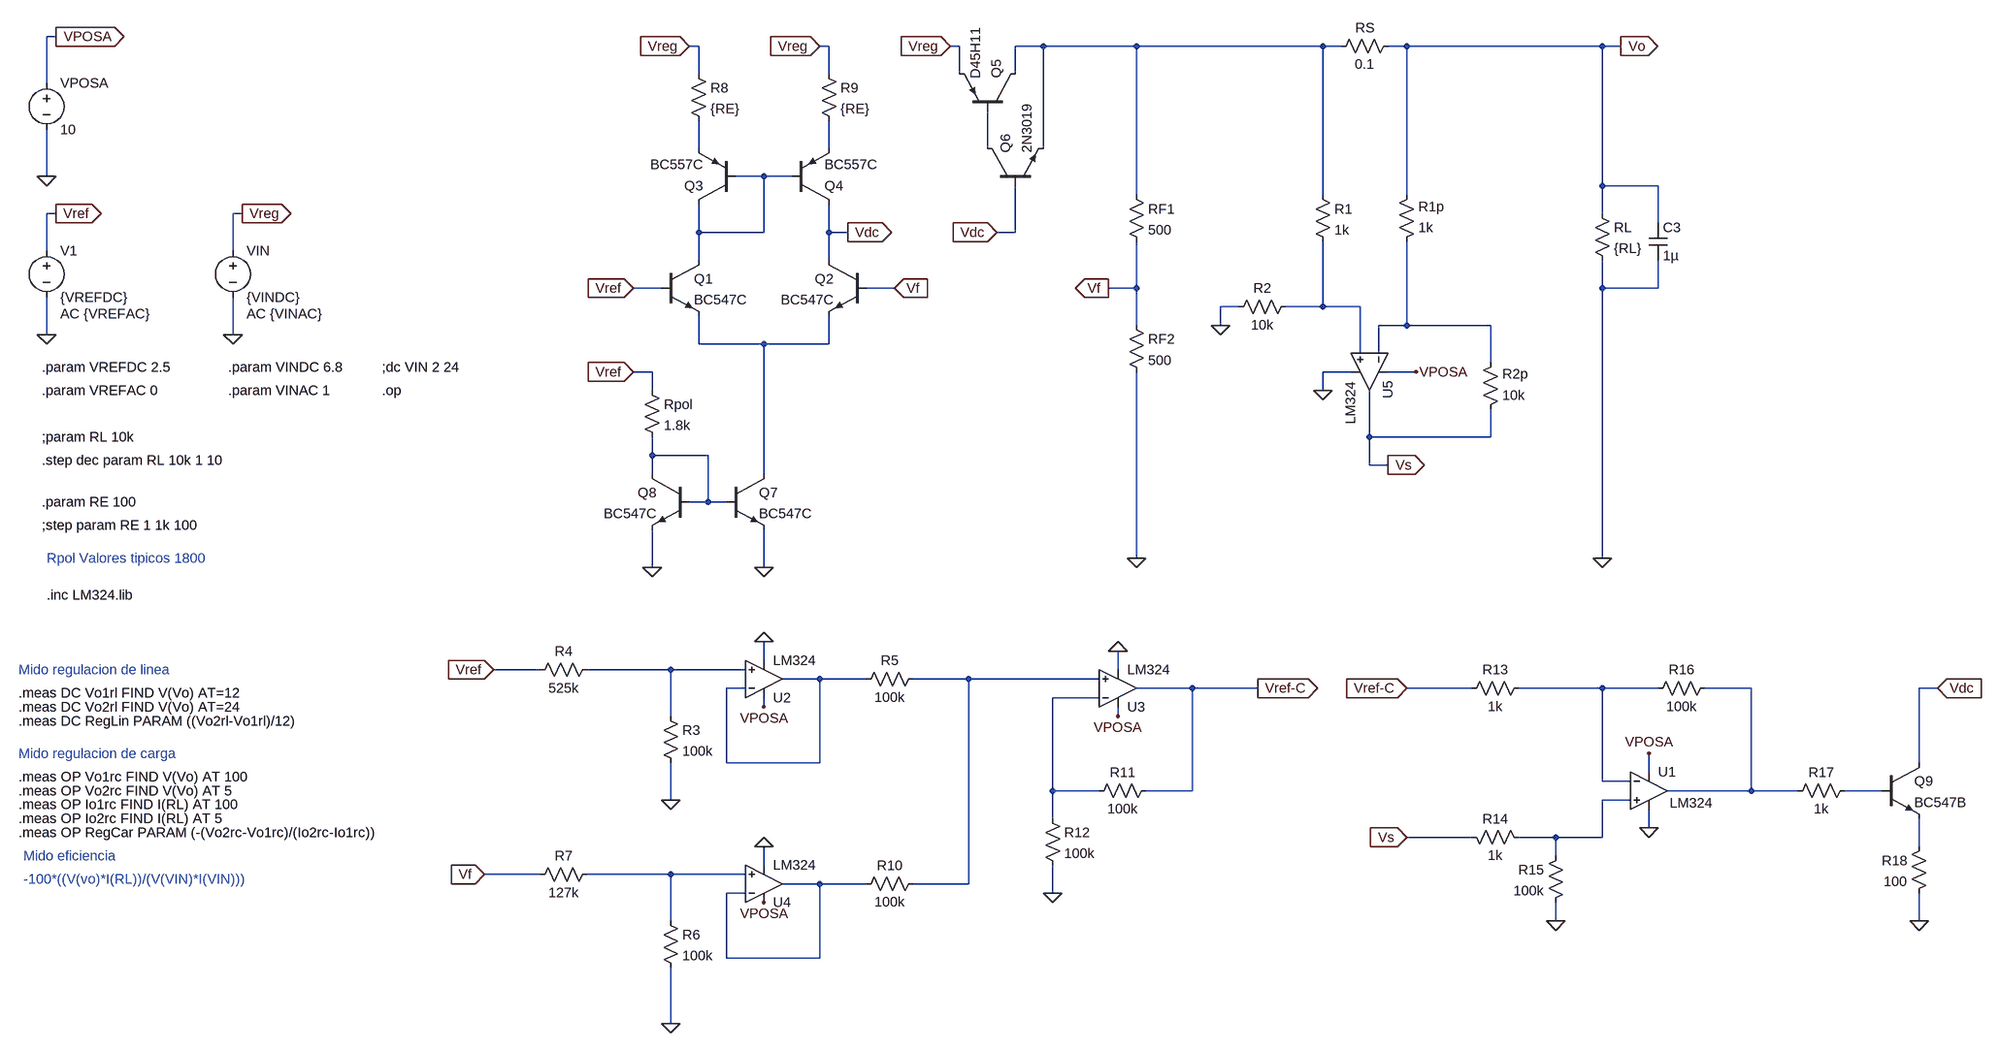
[diagram p0: schematic Version 3.asc]
Version 3.asc, the LTspice schematic file:
Version 4
SHEET 1 3148 2132
WIRE -1008 -144 -1024 -144
WIRE 96 -128 80 -128
WIRE 320 -128 304 -128
WIRE 544 -128 528 -128
WIRE 688 -128 640 -128
WIRE 848 -128 688 -128
WIRE 1168 -128 848 -128
WIRE 1200 -128 1168 -128
WIRE 1312 -128 1280 -128
WIRE 1648 -128 1312 -128
WIRE 1680 -128 1648 -128
WIRE 96 -80 96 -128
WIRE 320 -80 320 -128
WIRE 544 -80 544 -128
WIRE 640 -80 640 -128
WIRE -1024 -64 -1024 -144
WIRE 96 48 96 0
WIRE 320 48 320 0
WIRE 592 48 592 -16
WIRE 688 48 688 -128
WIRE -1024 96 -1024 16
WIRE 208 96 160 96
WIRE 256 96 208 96
WIRE 1648 112 1648 -128
WIRE 1744 112 1648 112
WIRE 848 128 848 -128
WIRE 1168 128 1168 -128
WIRE 1312 128 1312 -128
WIRE -1008 160 -1024 160
WIRE -688 160 -704 160
WIRE 1648 160 1648 112
WIRE 1744 176 1744 112
WIRE 96 192 96 144
WIRE 208 192 208 96
WIRE 208 192 96 192
WIRE 320 192 320 144
WIRE 352 192 320 192
WIRE 640 192 640 112
WIRE 640 192 608 192
WIRE -1024 224 -1024 160
WIRE -704 224 -704 160
WIRE 96 240 96 192
WIRE 320 240 320 192
WIRE 32 288 -16 288
WIRE 432 288 384 288
WIRE 848 288 848 208
WIRE 848 288 800 288
WIRE 1648 288 1648 240
WIRE 1744 288 1744 240
WIRE 1744 288 1648 288
WIRE 1024 320 992 320
WIRE 1168 320 1168 208
WIRE 1168 320 1104 320
WIRE 1232 320 1168 320
WIRE 848 352 848 288
WIRE 992 352 992 320
WIRE 1312 352 1312 208
WIRE 1312 352 1264 352
WIRE 1456 352 1312 352
WIRE -1024 368 -1024 304
WIRE -704 368 -704 304
WIRE 96 384 96 336
WIRE 208 384 96 384
WIRE 320 384 320 336
WIRE 320 384 208 384
WIRE 1232 400 1232 320
WIRE 1264 400 1264 352
WIRE 1456 416 1456 352
WIRE 16 432 -16 432
WIRE 1216 432 1168 432
WIRE 1328 432 1280 432
WIRE 16 464 16 432
WIRE 1168 464 1168 432
WIRE 1248 544 1248 464
WIRE 1456 544 1456 496
WIRE 1456 544 1248 544
WIRE 16 576 16 544
WIRE 112 576 16 576
WIRE 1248 592 1248 544
WIRE 1280 592 1248 592
WIRE 16 608 16 576
WIRE 208 608 208 384
WIRE 112 656 112 576
WIRE 112 656 80 656
WIRE 144 656 112 656
WIRE 848 752 848 432
WIRE 1648 752 1648 288
WIRE 16 768 16 704
WIRE 208 768 208 704
WIRE 208 928 208 896
WIRE -176 944 -256 944
WIRE 48 944 -96 944
WIRE 176 944 48 944
WIRE 816 944 816 912
WIRE 304 960 240 960
WIRE 384 960 304 960
WIRE 560 960 464 960
WIRE 784 960 560 960
WIRE 176 976 144 976
WIRE 944 976 848 976
WIRE 1056 976 944 976
WIRE 1424 976 1312 976
WIRE 1648 976 1504 976
WIRE 1744 976 1648 976
WIRE 1904 976 1824 976
WIRE 2224 976 2192 976
WIRE 784 992 704 992
WIRE 208 1008 208 992
WIRE 48 1024 48 944
WIRE 816 1024 816 1008
WIRE 144 1104 144 976
WIRE 304 1104 304 960
WIRE 304 1104 144 1104
WIRE 2192 1104 2192 976
WIRE 1728 1120 1728 1088
WIRE 1648 1136 1648 976
WIRE 1696 1136 1648 1136
WIRE 704 1152 704 992
WIRE 784 1152 704 1152
WIRE 944 1152 944 976
WIRE 944 1152 864 1152
WIRE 1904 1152 1904 976
WIRE 1904 1152 1760 1152
WIRE 1984 1152 1904 1152
WIRE 2128 1152 2064 1152
WIRE 48 1168 48 1104
WIRE 1696 1168 1648 1168
WIRE 704 1200 704 1152
WIRE 1728 1216 1728 1184
WIRE 1424 1232 1312 1232
WIRE 1568 1232 1504 1232
WIRE 1648 1232 1648 1168
WIRE 1648 1232 1568 1232
WIRE 2192 1248 2192 1200
WIRE 1568 1264 1568 1232
WIRE 208 1280 208 1248
WIRE -176 1296 -272 1296
WIRE 48 1296 -96 1296
WIRE 176 1296 48 1296
WIRE 304 1312 240 1312
WIRE 384 1312 304 1312
WIRE 560 1312 560 960
WIRE 560 1312 464 1312
WIRE 176 1328 144 1328
WIRE 704 1328 704 1280
WIRE 48 1376 48 1296
WIRE 1568 1376 1568 1344
WIRE 2192 1376 2192 1328
WIRE 144 1440 144 1328
WIRE 304 1440 304 1312
WIRE 304 1440 144 1440
WIRE 48 1552 48 1456
FLAG 1680 -128 Vo
IOPIN 1680 -128 Out
FLAG -1008 160 Vref
IOPIN -1008 160 Out
FLAG -1024 368 0
FLAG -688 160 Vreg
IOPIN -688 160 Out
FLAG 1648 752 0
FLAG 848 752 0
FLAG -16 288 Vref
IOPIN -16 288 In
FLAG -16 432 Vref
IOPIN -16 432 In
FLAG -704 368 0
FLAG 16 768 0
FLAG 208 768 0
FLAG 80 -128 Vreg
IOPIN 80 -128 In
FLAG 304 -128 Vreg
IOPIN 304 -128 In
FLAG 528 -128 Vreg
IOPIN 528 -128 In
FLAG 1568 1376 0
FLAG 2192 1376 0
FLAG 48 1168 0
FLAG 48 1552 0
FLAG 704 1328 0
FLAG 208 1008 VPOSA
FLAG 816 1024 VPOSA
FLAG 1728 1088 VPOSA
FLAG 208 1344 VPOSA
FLAG 208 1248 0
FLAG 208 896 0
FLAG 816 912 0
FLAG 1728 1216 0
FLAG -272 1296 Vf
IOPIN -272 1296 In
FLAG -256 944 Vref
IOPIN -256 944 In
FLAG 1312 976 Vref-C
IOPIN 1312 976 In
FLAG 1312 1232 Vs
IOPIN 1312 1232 In
FLAG 1056 976 Vref-C
IOPIN 1056 976 Out
FLAG 1328 432 VPOSA
FLAG 992 352 0
FLAG 1168 464 0
FLAG 1280 592 Vs
IOPIN 1280 592 Out
FLAG -1024 96 0
FLAG -1008 -144 VPOSA
IOPIN -1008 -144 Out
FLAG 352 192 Vdc
IOPIN 352 192 Out
FLAG 608 192 Vdc
IOPIN 608 192 In
FLAG 2224 976 Vdc
IOPIN 2224 976 In
FLAG 800 288 Vf
IOPIN 800 288 Out
FLAG 432 288 Vf
IOPIN 432 288 In
DATAFLAG 16 288 ""
DATAFLAG 112 192 ""
DATAFLAG 224 96 ""
DATAFLAG 320 32 ""
DATAFLAG 48 944 ""
DATAFLAG 48 1296 ""
DATAFLAG -224 1296 ""
DATAFLAG -224 944 ""
DATAFLAG 1008 -128 ""
DATAFLAG 432 288 ""
DATAFLAG 848 288 ""
SYMBOL pnp 160 144 R180
SYMATTR InstName Q3
SYMATTR Value BC557C
SYMBOL pnp 256 144 M180
SYMATTR InstName Q4
SYMATTR Value BC557C
SYMBOL npn 32 240 R0
SYMATTR InstName Q1
SYMATTR Value BC547C
SYMBOL npn 384 240 M0
SYMATTR InstName Q2
SYMATTR Value BC547C
SYMBOL pnp 640 -16 M270
SYMATTR InstName Q5
SYMATTR Value D45H11
SYMBOL npn 592 112 R270
SYMATTR InstName Q6
SYMATTR Value 2N3019
SYMBOL res 832 112 R0
SYMATTR InstName RF1
SYMATTR Value 500
SYMBOL res 832 336 R0
SYMATTR InstName RF2
SYMATTR Value 500
SYMBOL res 1632 144 R0
SYMATTR InstName RL
SYMATTR Value {RL}
SYMBOL voltage -1024 208 R0
WINDOW 123 24 124 Left 2
WINDOW 39 0 0 Left 0
SYMATTR Value2 AC {VREFAC}
SYMATTR InstName V1
SYMATTR Value {VREFDC}
SYMBOL res 80 -96 R0
SYMATTR InstName R8
SYMATTR Value {RE}
SYMBOL res 304 -96 R0
SYMATTR InstName R9
SYMATTR Value {RE}
SYMBOL cap 1728 176 R0
SYMATTR InstName C3
SYMATTR Value 1µ
SYMBOL voltage -704 208 R0
WINDOW 123 24 124 Left 2
WINDOW 39 0 0 Left 0
SYMATTR Value2 AC {VINAC}
SYMATTR InstName VIN
SYMATTR Value {VINDC}
SYMBOL npn 144 608 R0
SYMATTR InstName Q7
SYMATTR Value BC547C
SYMBOL npn 80 608 M0
SYMATTR InstName Q8
SYMATTR Value BC547C
SYMBOL res 0 448 R0
SYMATTR InstName Rpol
SYMATTR Value 1.8k
SYMBOL npn 2128 1104 R0
SYMATTR InstName Q9
SYMATTR Value BC547B
SYMBOL OpAmps\\opamp2 1728 1088 R0
WINDOW 3 36 85 Left 2
SYMATTR Value LM324
SYMATTR InstName U1
SYMBOL OpAmps\\opamp2 208 1024 M180
SYMATTR InstName U2
SYMATTR Value LM324
SYMBOL OpAmps\\opamp2 816 1040 M180
SYMATTR InstName U3
SYMATTR Value LM324
SYMBOL OpAmps\\opamp2 208 1376 M180
SYMATTR InstName U4
SYMATTR Value LM324
SYMBOL res 1296 -144 R90
WINDOW 0 0 56 VBottom 2
WINDOW 3 32 56 VTop 2
SYMATTR InstName RS
SYMATTR Value 0.1
SYMBOL OpAmps\\opamp2 1312 432 R90
SYMATTR InstName U5
SYMATTR Value LM324
SYMBOL voltage -1024 -80 R0
SYMATTR InstName VPOSA
SYMATTR Value 10
SYMBOL res 1152 112 R0
SYMATTR InstName R1
SYMATTR Value 1k
SYMBOL res 1120 304 R90
WINDOW 0 0 56 VBottom 2
WINDOW 3 32 56 VTop 2
SYMATTR InstName R2
SYMATTR Value 10k
SYMBOL res 1296 224 M180
WINDOW 0 36 76 Left 2
WINDOW 3 36 40 Left 2
SYMATTR InstName R1p
SYMATTR Value 1k
SYMBOL res 1440 512 M180
WINDOW 0 36 76 Left 2
WINDOW 3 36 40 Left 2
SYMATTR InstName R2p
SYMATTR Value 10k
SYMBOL res 32 1008 R0
SYMATTR InstName R3
SYMATTR Value 100k
SYMBOL res -80 928 R90
WINDOW 0 0 56 VBottom 2
WINDOW 3 32 56 VTop 2
SYMATTR InstName R4
SYMATTR Value 525k
SYMBOL res 480 944 R90
WINDOW 0 0 56 VBottom 2
WINDOW 3 32 56 VTop 2
SYMATTR InstName R5
SYMATTR Value 100k
SYMBOL res 32 1360 R0
SYMATTR InstName R6
SYMATTR Value 100k
SYMBOL res -80 1280 R90
WINDOW 0 0 56 VBottom 2
WINDOW 3 32 56 VTop 2
SYMATTR InstName R7
SYMATTR Value 127k
SYMBOL res 480 1296 R90
WINDOW 0 0 56 VBottom 2
WINDOW 3 32 56 VTop 2
SYMATTR InstName R10
SYMATTR Value 100k
SYMBOL res 880 1136 R90
WINDOW 0 0 56 VBottom 2
WINDOW 3 32 56 VTop 2
SYMATTR InstName R11
SYMATTR Value 100k
SYMBOL res 688 1184 R0
SYMATTR InstName R12
SYMATTR Value 100k
SYMBOL res 1408 992 R270
WINDOW 0 32 56 VTop 2
WINDOW 3 0 56 VBottom 2
SYMATTR InstName R13
SYMATTR Value 1k
SYMBOL res 1408 1216 M90
WINDOW 0 0 56 VBottom 2
WINDOW 3 32 56 VTop 2
SYMATTR InstName R14
SYMATTR Value 1k
SYMBOL res 1584 1248 M0
SYMATTR InstName R15
SYMATTR Value 100k
SYMBOL res 1728 992 R270
WINDOW 0 32 56 VTop 2
WINDOW 3 0 56 VBottom 2
SYMATTR InstName R16
SYMATTR Value 100k
SYMBOL res 1968 1168 R270
WINDOW 0 32 56 VTop 2
WINDOW 3 0 56 VBottom 2
SYMATTR InstName R17
SYMATTR Value 1k
SYMBOL res 2208 1232 M0
SYMATTR InstName R18
SYMATTR Value 100
TEXT -448 464 Left 2 !.op
TEXT -712 424 Left 2 !.param VINDC 6.8
TEXT -712 464 Left 2 !.param VINAC 1
TEXT -1032 424 Left 2 !.param VREFDC 2.5
TEXT -1032 464 Left 2 !.param VREFAC 0
TEXT -1032 544 Left 2 !;param RL 10k
TEXT -448 424 Left 2 !;dc VIN 2 24
TEXT -1032 696 Left 2 !;step param RE 1 1k 100
TEXT -1032 656 Left 2 !.param RE 100
TEXT -1032 584 Left 2 !.step dec param RL 10k 1 10
TEXT -1072 944 Left 2 ;Mido regulacion de linea
TEXT -1072 984 Left 2 !.meas DC Vo1rl FIND V(Vo) AT=12
TEXT -1072 1008 Left 2 !.meas DC Vo2rl FIND V(Vo) AT=24
TEXT -1072 1032 Left 2 !.meas DC RegLin PARAM ((Vo2rl-Vo1rl)/12)
TEXT -1072 1088 Left 2 ;Mido regulacion de carga
TEXT -1072 1128 Left 2 !.meas OP Vo1rc FIND V(Vo) AT 100
TEXT -1072 1152 Left 2 !.meas OP Vo2rc FIND V(Vo) AT 5
TEXT -1072 1176 Left 2 !.meas OP Io1rc FIND I(RL) AT 100
TEXT -1072 1200 Left 2 !.meas OP Io2rc FIND I(RL) AT 5
TEXT -1064 1264 Left 2 ;Mido eficiencia
TEXT -1064 1304 Left 2 ;-100*((V(vo)*I(RL))/(V(VIN)*I(VIN)))
TEXT -1072 1224 Left 2 !.meas OP RegCar PARAM (-(Vo2rc-Vo1rc)/(Io2rc-Io1rc))
TEXT -1024 752 Left 2 ;Rpol Valores tipicos 1800
TEXT -1024 816 Left 2 !.inc LM324.lib

The netlist it stands for:
* Version 3.asc
Q3 N005 N005 N002 0 BC557C
Q4 Vdc N005 N003 0 BC557C
Q1 N005 Vref N008 0 BC547C
Q2 Vdc Vf N008 0 BC547C
Q5 N001 N004 Vreg 0 D45H11
Q6 N004 Vdc N001 0 2N3019
RF1 N001 Vf 500
RF2 Vf 0 500
RL Vo 0 {RL}
V1 Vref 0 {VREFDC} AC {VREFAC}
R8 Vreg N002 {RE}
R9 Vreg N003 {RE}
C3 Vo 0 1µ
VIN Vreg 0 {VINDC} AC {VINAC}
Q7 N008 N009 0 0 BC547C
Q8 N009 N009 0 0 BC547C
Rpol Vref N009 1.8k
Q9 Vdc N016 N018 0 BC547B
XU1 N017 N013 VPOSA 0 N014 LM324  ; pins In+ In- V+ V- OUT
XU2 N010 N011 VPOSA 0 N011 LM324  ; pins In+ In- V+ V- OUT
XU3 N012 N015 VPOSA 0 Vref-C LM324  ; pins In+ In- V+ V- OUT
XU4 N019 N020 VPOSA 0 N020 LM324  ; pins In+ In- V+ V- OUT
RS Vo N001 0.1
XU5 N006 N007 VPOSA 0 Vs LM324  ; pins In+ In- V+ V- OUT
VPOSA VPOSA 0 10
R1 N001 N006 1k
R2 N006 0 10k
R1p N007 Vo 1k
R2p Vs N007 10k
R3 N010 0 100k
R4 N010 Vref 525k
R5 N012 N011 100k
R6 N019 0 100k
R7 N019 Vf 127k
R10 N012 N020 100k
R11 Vref-C N015 100k
R12 N015 0 100k
R13 Vref-C N013 1k
R14 Vs N017 1k
R15 N017 0 100k
R16 N013 N014 100k
R17 N014 N016 1k
R18 N018 0 100
.model NPN NPN
.model PNP PNP
.lib standard.bjt
.op
.param VINDC 6.8
.param VINAC 1
.param VREFDC 2.5
.param VREFAC 0
;param RL 10k
;dc VIN 2 24
;step param RE 1 1k 100
.param RE 100
.step dec param RL 10k 1 10
* Mido regulacion de linea
.meas DC Vo1rl FIND V(Vo) AT=12
.meas DC Vo2rl FIND V(Vo) AT=24
.meas DC RegLin PARAM ((Vo2rl-Vo1rl)/12)
* Mido regulacion de carga
.meas OP Vo1rc FIND V(Vo) AT 100
.meas OP Vo2rc FIND V(Vo) AT 5
.meas OP Io1rc FIND I(RL) AT 100
.meas OP Io2rc FIND I(RL) AT 5
* Mido eficiencia
* -100*((V(vo)*I(RL))/(V(VIN)*I(VIN)))
.meas OP RegCar PARAM (-(Vo2rc-Vo1rc)/(Io2rc-Io1rc))
* Rpol Valores tipicos 1800
.inc LM324.lib
.backanno
.end

* Results of the author's LTspice run, read from the files saved beside the schematic
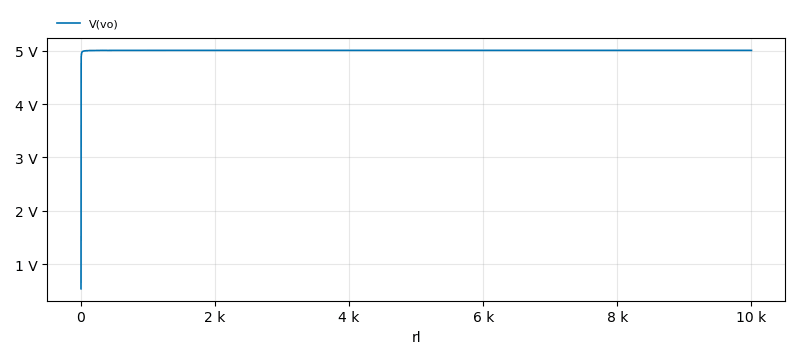
[diagram p1: Operating Point of Version 3.asc, plotted from the saved traces]
* Operating Point, 1 run:
*   V(vo): 539.5 mV at rl=1 , 5.007 V at rl=10 k, min 539.5 mV, max 5.007 V
* From the log:
*   Semiconductor Device Operating Points:
*                           --- Diodes ---
*   Name:    d:u5:p      d:u5:ln     d:u5:lp     d:u5:e      d:u5:c
*   Model:    u5:dx       u5:dx       u5:dx       u5:dx       u5:dx
*   Id:     -1.00e-11   -4.00e-11   -4.00e-11    6.42e-14   -7.36e-12
*   Vd:     -1.00e+01   -4.00e+01   -4.00e+01    5.76e-02   -7.36e+00
*   Req:     1.00e+12    1.00e+12    1.00e+12    7.77e+11    1.00e+12
*   CAP:     0.00e+00    0.00e+00    0.00e+00    0.00e+00    0.00e+00
*   Name:    d:u4:p      d:u4:ln     d:u4:lp     d:u4:e      d:u4:c
*   Model:    u4:dx       u4:dx       u4:dx       u4:dx       u4:dx
*   Id:     -1.00e-11   -4.00e-11   -4.00e-11    5.64e-08   -7.77e-12
*   Vd:     -1.00e+01   -4.00e+01   -4.00e+01    4.67e-01   -7.77e+00
*   Req:     1.00e+12    1.00e+12    1.00e+12    4.58e+05    1.00e+12
*   CAP:     0.00e+00    0.00e+00    0.00e+00    0.00e+00    0.00e+00
*   Name:    d:u3:p      d:u3:ln     d:u3:lp     d:u3:e      d:u3:c
*   Model:    u3:dx       u3:dx       u3:dx       u3:dx       u3:dx
*   Id:     -1.00e-11   -4.00e-11   -4.00e-11    7.39e-14   -7.37e-12
*   Vd:     -1.00e+01   -4.00e+01   -4.00e+01    6.49e-02   -7.36e+00
*   Req:     1.00e+12    1.00e+12    1.00e+12    7.25e+11    1.00e+12
*   CAP:     0.00e+00    0.00e+00    0.00e+00    0.00e+00    0.00e+00
*   Name:    d:u2:p      d:u2:ln     d:u2:lp     d:u2:e      d:u2:c
*   Model:    u2:dx       u2:dx       u2:dx       u2:dx       u2:dx
*   Id:     -1.00e-11   -4.00e-11   -4.00e-11    1.89e-12   -7.50e-12
*   Vd:     -1.00e+01   -4.00e+01   -4.00e+01    1.98e-01   -7.50e+00
*   Req:     1.00e+12    1.00e+12    1.00e+12    1.51e+10    1.00e+12
*   CAP:     0.00e+00    0.00e+00    0.00e+00    0.00e+00    0.00e+00
*   Name:    d:u1:p      d:u1:ln     d:u1:lp     d:u1:e      d:u1:c
*   Model:    u1:dx       u1:dx       u1:dx       u1:dx       u1:dx
*   Id:     -1.00e-11   -4.00e-11   -4.00e-11   -1.52e-13   -7.15e-12
*   Vd:     -1.00e+01   -4.00e+01   -4.00e+01   -1.52e-01   -7.15e+00
*   Req:     1.00e+12    1.00e+12    1.00e+12    1.00e+12    1.00e+12
*   CAP:     0.00e+00    0.00e+00    0.00e+00    0.00e+00    0.00e+00
*                           --- Bipolar Transistors ---
*   Name:     q:u5:2      q:u5:1      q:u4:2      q:u4:1      q:u3:2
*   Model:     u5:qx       u5:qx       u4:qx       u4:qx       u3:qx
*   Ib:      -2.05e-08   -2.03e-08   -2.06e-08   -2.02e-08   -2.05e-08
*   Ic:      -5.11e-06   -5.08e-06   -5.16e-06   -5.05e-06   -5.12e-06
*   Vbe:     -5.84e-01   -5.84e-01   -5.84e-01   -5.84e-01   -5.84e-01
*   Vbc:      4.99e-01    4.99e-01    9.07e-02    9.24e-02    2.28e-01
*   Vce:     -1.08e+00   -1.08e+00   -6.75e-01   -6.76e-01   -8.12e-01
*   BetaDC:   2.50e+02    2.50e+02    2.50e+02    2.50e+02    2.50e+02
*   Gm:       1.98e-04    1.96e-04    2.00e-04    1.95e-04    1.98e-04
*   Rpi:      1.26e+06    1.27e+06    1.25e+06    1.28e+06    1.26e+06
*   Rx:       0.00e+00    0.00e+00    0.00e+00    0.00e+00    0.00e+00
*   Ro:       7.69e+21    7.85e+21    1.08e+15    1.15e+15    2.14e+17
*   Cbe:      0.00e+00    0.00e+00    0.00e+00    0.00e+00    0.00e+00
*   Cbc:      0.00e+00    0.00e+00    0.00e+00    0.00e+00    0.00e+00
*   Cjs:      0.00e+00    0.00e+00    0.00e+00    0.00e+00    0.00e+00
*   BetaAC:   2.50e+02    2.50e+02    2.50e+02    2.50e+02    2.50e+02
*   Cbx:      0.00e+00    0.00e+00    0.00e+00    0.00e+00    0.00e+00
*   Ft:       0.00e+00    0.00e+00    0.00e+00    0.00e+00    0.00e+00
*   Name:     q:u3:1      q:u2:2      q:u2:1      q:u1:2      q:u1:1
*   Model:     u3:qx       u2:qx       u2:qx       u1:qx       u1:qx
*   Ib:      -2.03e-08   -2.05e-08   -2.03e-08   -2.05e-08   -2.03e-08
*   Ic:      -5.09e-06   -5.12e-06   -5.08e-06   -5.11e-06   -5.08e-06
*   Vbe:     -5.84e-01   -5.84e-01   -5.84e-01   -5.84e-01   -5.84e-01
*   Vbc:      2.28e-01    3.61e-01    3.62e-01    4.96e-01    4.97e-01
*   Vce:     -8.12e-01   -9.45e-01   -9.45e-01   -1.08e+00   -1.08e+00
*   BetaDC:   2.50e+02    2.50e+02    2.50e+02    2.50e+02    2.50e+02
*   Gm:       1.97e-04    1.98e-04    1.97e-04    1.98e-04    1.96e-04
*   Rpi:      1.27e+06    1.26e+06    1.27e+06    1.26e+06    1.27e+06
*   Rx:       0.00e+00    0.00e+00    0.00e+00    0.00e+00    0.00e+00
*   Ro:       2.19e+17    3.73e+19    3.80e+19    6.98e+21    7.12e+21
*   Cbe:      0.00e+00    0.00e+00    0.00e+00    0.00e+00    0.00e+00
*   Cbc:      0.00e+00    0.00e+00    0.00e+00    0.00e+00    0.00e+00
*   Cjs:      0.00e+00    0.00e+00    0.00e+00    0.00e+00    0.00e+00
*   BetaAC:   2.50e+02    2.50e+02    2.50e+02    2.50e+02    2.50e+02
*   Cbx:      0.00e+00    0.00e+00    0.00e+00    0.00e+00    0.00e+00
*   Ft:       0.00e+00    0.00e+00    0.00e+00    0.00e+00    0.00e+00
*   Name:       q9          q6          q5          q8          q7
*   Model:    bc547b      2n3019      d45h11      bc547c      bc547c
*   Ib:       3.75e-06    2.67e-05   -5.57e-03    2.30e-06    2.29e-06
*   Ic:       1.07e-03    5.57e-03   -5.35e-01    1.04e-03    1.06e-03
*   Vbe:      6.41e-01    6.90e-01   -5.02e-01    6.23e-01    6.23e-01
*   Vbc:     -5.36e-01   -5.01e+00    5.70e+00    0.00e+00   -1.26e+00
*   Vce:      1.18e+00    5.70e+00   -6.21e+00    6.23e-01    1.88e+00
*   BetaDC:   2.85e+02    2.09e+02    9.60e+01    4.52e+02    4.63e+02
*   Gm:       4.06e-02    2.14e-01    2.34e+01    3.94e-02    4.04e-02
*   Rpi:      6.96e+03    9.69e+02    3.95e+00    1.14e+04    1.14e+04
*   Rx:       1.00e+00    1.00e+01    2.14e+00    1.00e+00    1.00e+00
*   Ro:       5.82e+04    1.89e+04    3.02e+01    5.06e+04    5.06e+04
*   Cbe:      6.42e-11    2.41e-10    9.35e-08    5.05e-11    5.09e-11
*   Cbc:      1.80e-12    7.68e-12    2.11e-10    2.74e-12    1.58e-12
*   Cjs:      0.00e+00    0.00e+00    0.00e+00    0.00e+00    0.00e+00
*   BetaAC:   2.83e+02    2.07e+02    9.26e+01    4.49e+02    4.60e+02
*   Cbx:      1.10e-12    0.00e+00    5.17e-11    1.69e-12    9.68e-13
*   Ft:       9.63e+07    1.37e+08    3.98e+07    1.14e+08    1.20e+08
*   Name:       q2          q1          q4          q3
*   Model:    bc547c      bc547c      bc557c      bc557c
*   Ib:      -2.60e-12    2.19e-06   -2.05e-06   -2.38e-06
*   Ic:       1.01e-12    1.06e-03   -1.10e-03   -1.06e-03
*   Vbe:     -1.58e+00    6.22e-01   -6.16e-01   -6.20e-01
*   Vbc:     -9.87e-01   -3.57e+00    4.79e+00    0.00e+00
*   Vce:     -5.95e-01    4.20e+00   -5.41e+00   -6.20e-01
*   BetaDC:  -3.90e-01    4.83e+02    5.34e+02    4.44e+02
*   Gm:      -9.87e-29    4.03e-02    4.13e-02    3.97e-02
*   Rpi:      1.00e+12    1.19e+04    1.29e+04    1.11e+04
*   Rx:       1.00e+00    1.00e+00    1.00e+00    1.00e+00
*   Ro:       1.01e+28    5.29e+04    2.60e+04    2.24e+04
*   Cbe:      7.80e-12    5.08e-11    5.34e-11    5.27e-11
*   Cbc:      1.67e-12    1.21e-12    1.79e-12    4.91e-12
*   Cjs:      0.00e+00    0.00e+00    0.00e+00    0.00e+00
*   BetaAC:  -9.87e-17    4.80e+02    5.32e+02    4.40e+02
*   Cbx:      1.02e-12    7.43e-13    1.05e-12    2.90e-12
*   Ft:       1.52e-02    1.22e+08    1.17e+08    1.04e+08
*   vo1rc: v(vo)=5.00123 at 100
*   vo2rc: v(vo)=4.90091 at 5
*   io1rc: i(rl)=0.0500123 at 100
*   io2rc: i(rl)=0.98076 at 5
*   regcar: (-(vo2rc-vo1rc)/(io2rc-io1rc))=0.10779